# EasyEDA Pro project ProProject_训练营23_2023-12-06.epro, schematic 不带频谱时钟
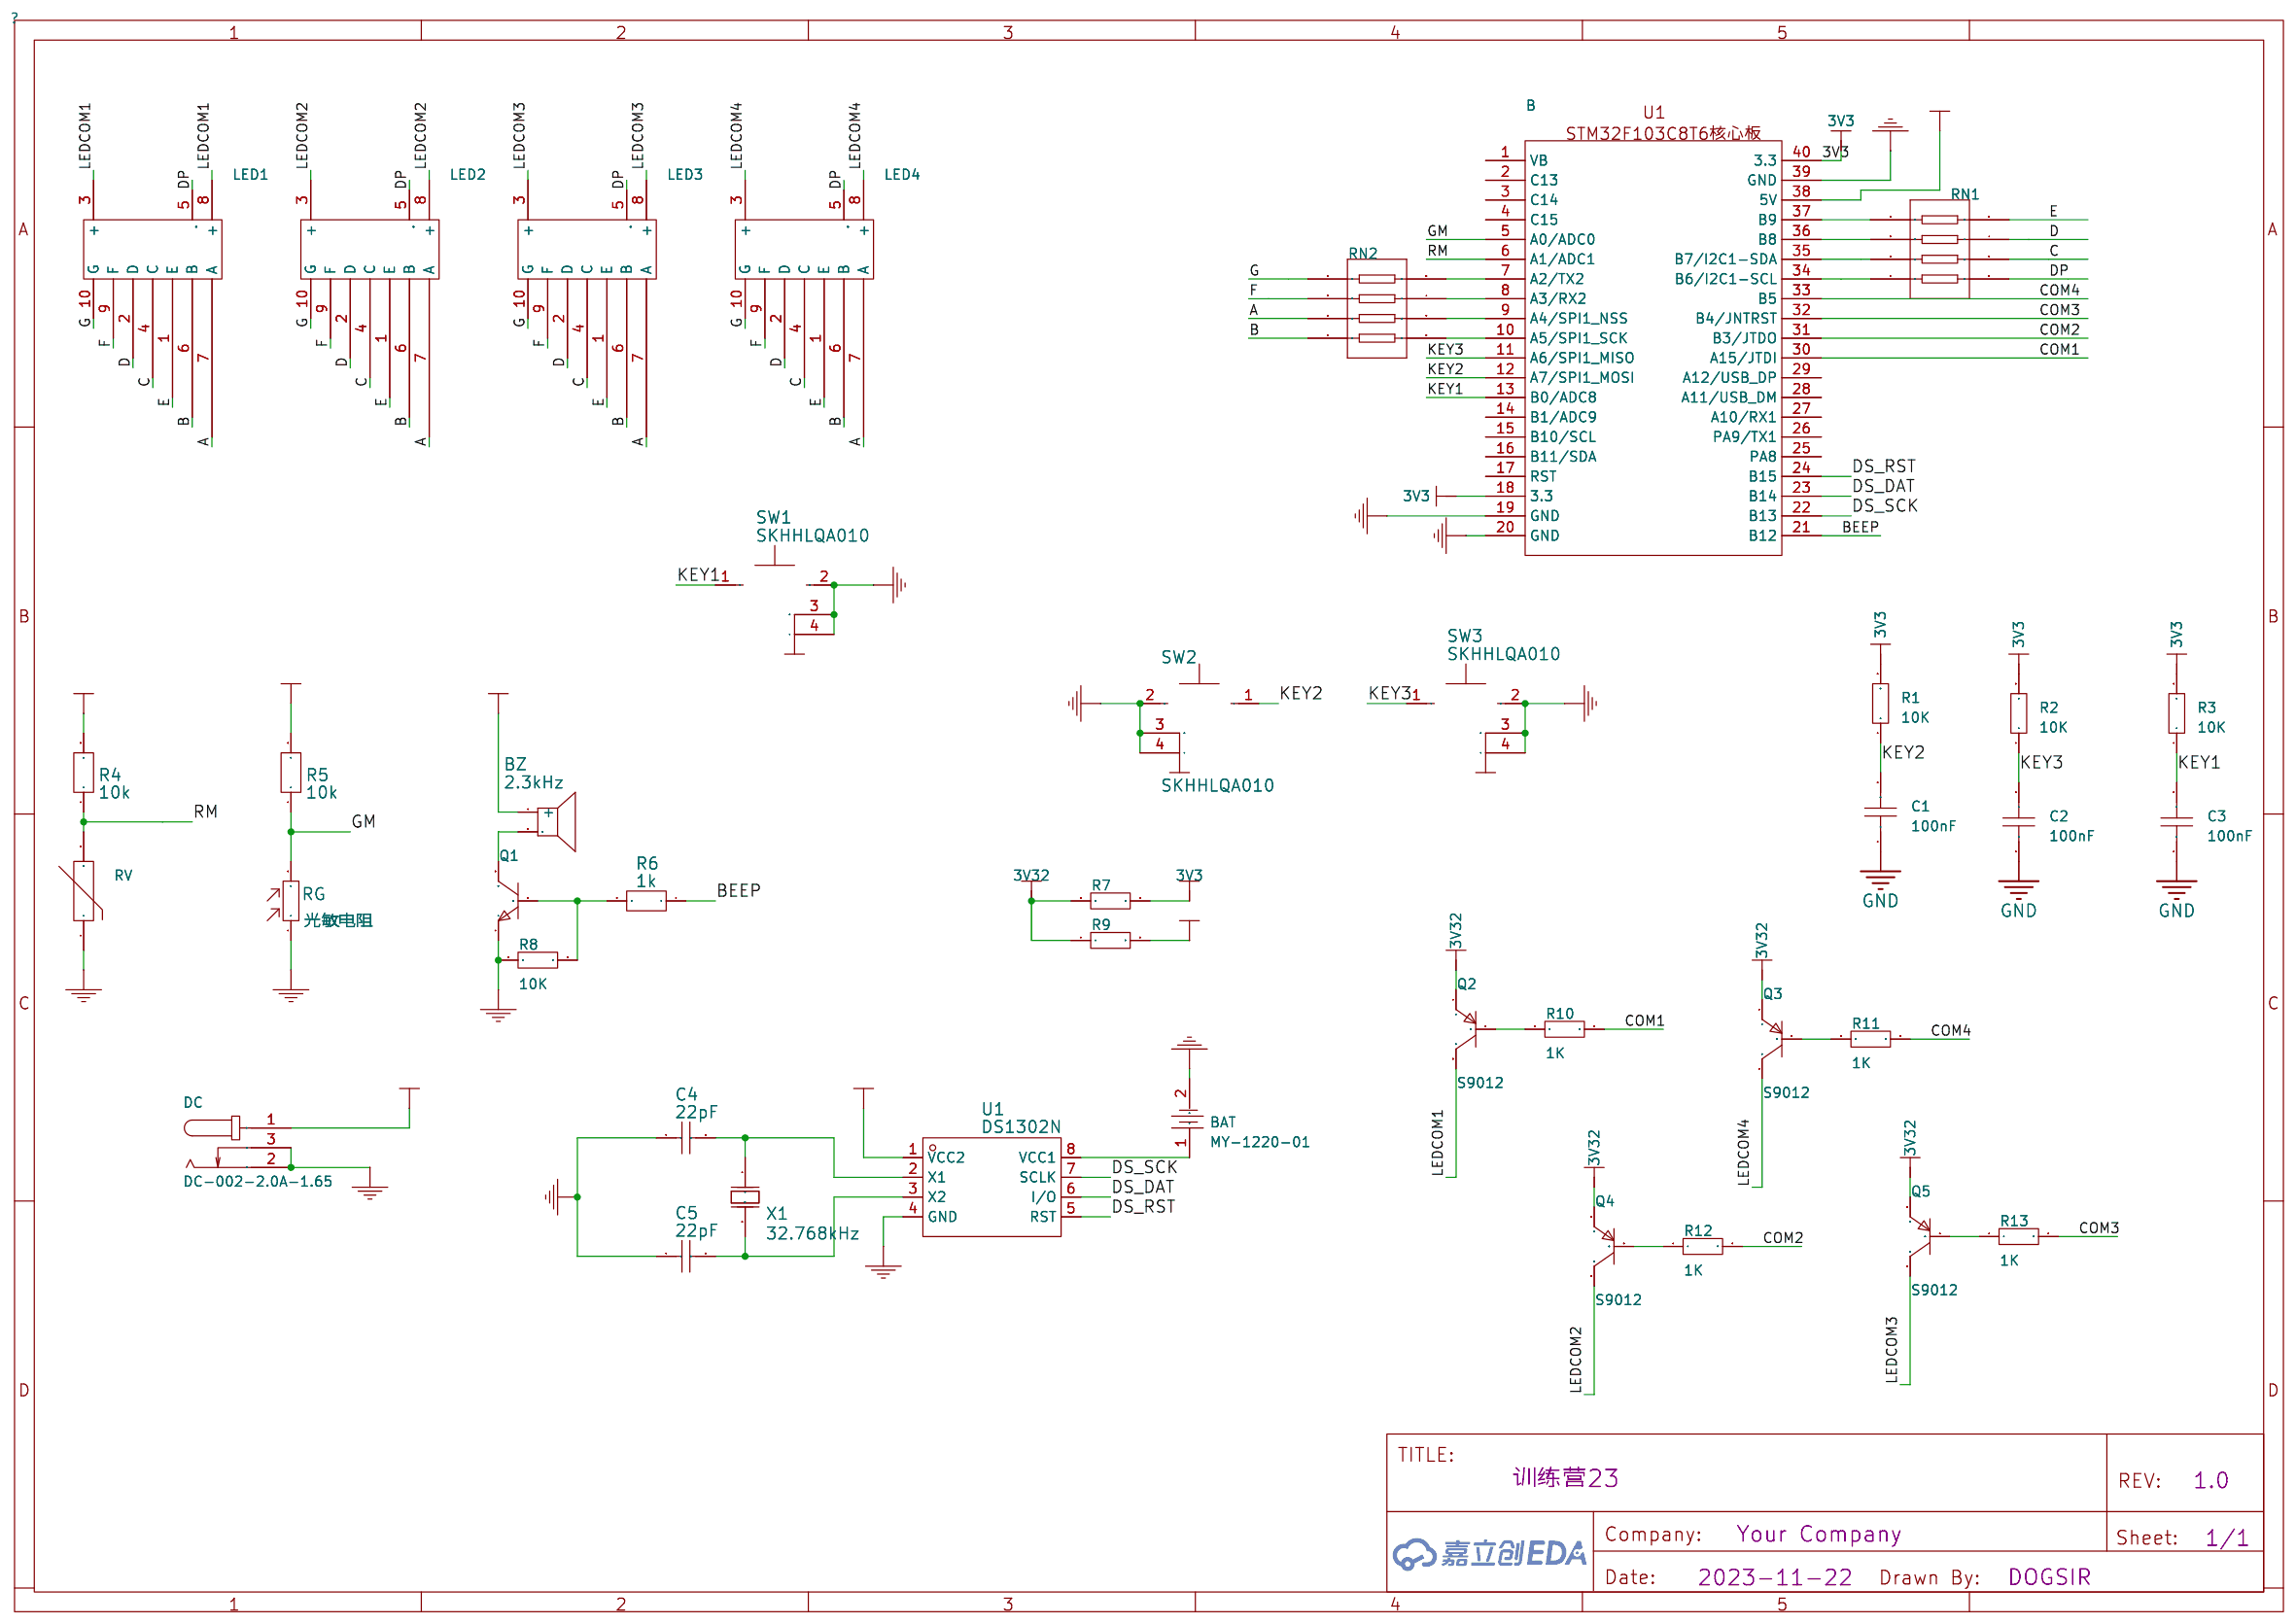
[diagram p0: schematic sheet]

## Parts
B  -  [STM32F103C8T6核心板]
BAT  MY-1220-01  [BAT-TH_MY-1220-01]
BZ  2.3kHz  [BUZ-TH_BD12.0-P7.60-D0.6-FD]
C1  100nF  [C0603]
C2  100nF  [C0603]
C3  100nF  [C0603]
C4  22pF  [C0603]
C5  22pF  [C0603]
DC  DC-002-2.0A-1.65  [DC-IN_DC-002-2.0A-1.65]
LED1  -  [1寸数码管]
LED2  -  [1寸数码管]
LED3  -  [1寸数码管]
LED4  -  [1寸数码管]
Q1  -  [S8050_TO_92]
Q2  S9012  [S8550P_TO-92]
Q3  S9012  [S8550P_TO-92]
Q4  S9012  [S8550P_TO-92]
Q5  S9012  [S8550P_TO-92]
R1  10K  [R0603]
R2  10K  [R0603]
R3  10K  [R0603]
R4  10k  [R0603]
R5  10k  [R0603]
R6  1k  [R0603]
R7  10K  [R0603]
R8  10K  [R0603]
R9  10K  [R0603]
R10  1K  [R0603]
R11  1K  [R0603]
R12  1K  [R0603]
R13  1K  [R0603]
RG  光敏电阻  [RES-TH_L5.1-W4.3-P3.40-D0.5]
RN1  470Ω  [RES-ARRAY-SMD_0603-8P-L3.2-W1.6-BL]
RN2  470Ω  [RES-ARRAY-SMD_0603-8P-L3.2-W1.6-BL]
RV  MF52A103F3950 (A1)  [RES-TH_L2.5-W2.5-P1.70-D0.3]
SW1  SKHHLQA010  [KEY-TH_4P-SKHHLQA010]
SW2  SKHHLQA010  [KEY-TH_4P-SKHHLQA010]
SW3  SKHHLQA010  [KEY-TH_4P-SKHHLQA010]
U1  DS1302N  [DIP-8_L9.7-W6.4-P2.54-LS7.6-BL]
X1  32.768kHz  [CRYSTAL-TH_BD2.1-P0.70-D0.3]

## Library data of the parts
B = STM32F103C8T6核心板
BAT = MY-1220-01: 连接器类型:电池扣;适用电池规格:CR1220;工作温度范围:-25℃~+85℃;; LCSC Part Name: 电池扣 适用电池:CR1220; Supplier Part: C964817; Manufacturer: MYOUNG(美阳); Supplier Footprint: 插件; JLCPCB Part Class: 扩展库; Datasheet: https://atta.szlcsc.com/upload/public/pdf/source/20201218/C964817_C6C7ADAA3E58F2D08F45EEE9D25BDAFE.pdf; Supplier: LCSC; Connector Type: 电池扣; Battery Type: CR1220; Operating Temperature Range: -25℃~+85℃
BZ = 2.3kHz: Supplier: LCSC; Manufacturer: 华能; Manufacturer Part: TMB12A05; Supplier Part: C96093; JLCPCB Part Class: Extended Part
C1-C3 = CAP_0603: Supplier Footprint: 0603
C4 C5 = 22pF: Supplier: LCSC; Supplier Part: C359297; Manufacturer: DARFON(达方); Manufacturer Part: C1608NP0122JGT; JLCPCB Part Class: Extended Part
DC = DC-002-2.0A-1.65: 连接器类型:DC电源插座;安装方式:弯插;触点内径:1.65mm;触点外径:4.2mm;额定电流:2A;额定电压:12V;触头材质:黄铜;工作温度范围:-20℃~+70℃;焊接温度(最大值):260℃;; LCSC Part Name: DC电源插座 内径:1.65mm 外径:4.2mm; Supplier Part: C692444; Manufacturer: XKB Connectivity(中国星坤); Supplier Footprint: 插件; JLCPCB Part Class: 扩展库; Datasheet: https://atta.szlcsc.com/upload/public/pdf/source/20211011/D8EEBFC3205CDB20BEF5BD9C2A833C06.pdf; Supplier: LCSC; Connector Type: DC电源插座; Mounting Style: 弯插; Inside Contact Diameter: 1.65mm; Outside Contact Diameter: 4.2mm; Current Rating (Max): 2A; Voltage Rating (Max): 12V; Contact Material: 黄铜; Operating Temperature Range: -20℃~+70℃; Welding Temperature (Max): 260℃
LED1-LED4 = 1寸数码管
Q1 = S8050_TO_NPN: Supplier Footprint: TO-92
Q2-Q5 = S8550_TO_PNP: Supplier Footprint: TO-92
R1-R3 R7-R13 = Res_0603: Supplier Footprint: 0603
R4-R6 = 10k: Supplier: LCSC; Supplier Part: C9900014833; Manufacturer: null; Manufacturer Part: 贴片电阻ChipResistors; JLCPCB Part Class: Extended Part
RG = GL5528(10-20): Supplier: LCSC; Manufacturer: ReliaPro; Supplier Part: C10081
RN1 RN2 = 4D03WGJ0471T5E: 阻值:470Ω;精度:±5%;单个元件功率:62.5mW;电阻器数:4;温度系数:±200ppm/℃;; LCSC Part Name: 470Ω ±5%; Supplier Part: C25510; Manufacturer: UNI-ROYAL(厚声); Supplier Footprint: 0603x4; Datasheet: https://atta.szlcsc.com/upload/public/pdf/source/20191224/C474318_2527498AE30E813171187CCD28401A71.pdf; Supplier: LCSC; Tolerance: ±5%; Power(Watts): 62.5mW; Number of Resistors: 4; Temperature Coefficient: ±200ppm/℃; Number of Pins: 8
RV = MF52A103F3950 (A1): 阻值(25℃):10kΩ;电阻精度:±1%;B值精度:±1%;B值(25℃/50℃):3950K;功率:50mW;最大稳态电流(25℃):-;B值(25℃/75℃):-;B值(25℃/85℃):-;B值(25℃/100℃):-;工作温度:-55℃~+125℃;; LCSC Part Name: 10kΩ 电阻精度:±1% 3950K; Supplier Part: C13879; Manufacturer: 时恒; Supplier Footprint: 直插,P=1.7mm; Datasheet: https://atta.szlcsc.com/upload/public/pdf/source/20181022/C13879_A3EC02A0ADE83AF2A724FC6C6FE0F41B.pdf; Supplier: LCSC; Resistance @ 25℃: 10kΩ; Resistance Tolerance: ±1%; B Constant Tolerance: ±1%; B Constant (25℃/50℃): 3950K; Power: 50mW; Operating Temperature: -55℃~+125℃
SW1-SW3 = SKHHLQA010: Supplier: LCSC; Manufacturer: ALPSALPINE(阿尔卑斯阿尔派); Supplier Part: C125034; JLCPCB Part Class: Extended Part
U1 = DS1302N: Supplier: LCSC; Supplier Part: C398065; Manufacturer: HGSEMI; JLCPCB Part Class: Extended Part
X1 = 32.768kHz: Supplier: LCSC; Supplier Part: C2934679; Manufacturer: KDS(大真空); Manufacturer Part: DT-26T 32.768K 20PPM 12.5PF; JLCPCB Part Class: Extended Part

## Nets
3V3: R1.2 R2.2 R3.2 R4.2 R5.2 R7.2
3V32: Q2.1(E) Q3.1(E) Q4.1(E) Q5.1(E) R7.1 R9.1
GND: BAT.2 C1.1 C2.1 C3.1 C4.1 C5.1 DC.2 DC.3 Q1.1(E) R8.1 RG.1 RV.1 SW1.2 SW1.3 SW1.4 SW2.2 SW2.3 SW2.4 SW3.2 SW3.3 SW3.4 U1.4(GND)
VCC: BZ.1(+) DC.1 R9.2 U1.1(VCC2)
A: LED1.7(A) LED2.7(A) LED3.7(A) LED4.7(A) RN2.3
B: LED1.6(B) LED2.6(B) LED3.6(B) LED4.6(B) RN2.4
BEEP: B.21(B12) R6.1
C: LED1.4(C) LED2.4(C) LED3.4(C) LED4.4(C) RN1.6
COM1: B.30(A15/JTDI) R10.2
COM2: B.31(B3/JTDO) R12.2
COM3: B.32(B4/JNTRST) R13.2
COM4: B.33(B5) R11.2
D: LED1.2(D) LED2.2(D) LED3.2(D) LED4.2(D) RN1.7
DP: LED1.5(.) LED2.5(.) LED3.5(.) LED4.5(.) RN1.5
DS_DAT: B.23(B14) U1.6(I/O)
DS_RST: B.24(B15) U1.5(RST)
DS_SCK: B.22(B13) U1.7(SCLK)
E: LED1.1(E) LED2.1(E) LED3.1(E) LED4.1(E) RN1.8
F: LED1.9(F) LED2.9(F) LED3.9(F) LED4.9(F) RN2.2
G: LED1.10(G) LED2.10(G) LED3.10(G) LED4.10(G) RN2.1
GM: B.5(A0/ADC0) R5.1 RG.2
KEY1: B.13(B0/ADC8) C3.2 R3.1 SW1.1
KEY2: B.12(A7/SPI1_MOSI) C1.2 R1.1 SW2.1
KEY3: B.11(A6/SPI1_MISO) C2.2 R2.1 SW3.1
LEDCOM1: LED1.3(+) LED1.8(+) Q2.3(C)
LEDCOM2: LED2.3(+) LED2.8(+) Q4.3(C)
LEDCOM3: LED3.3(+) LED3.8(+) Q5.3(C)
LEDCOM4: LED4.3(+) LED4.8(+) Q3.3(C)
RM: B.6(A1/ADC1) R4.1 RV.2
$1N45: BZ.2 Q1.3(C)
$1N120: BAT.1 U1.8(VCC1)
$1N175: C4.2 U1.2(X1) X1.1
$1N176: C5.2 U1.3(X2) X1.2
$1N3437: Q1.2(B) R6.2 R8.2
$1N3552: Q2.2(B) R10.1
$1N3648: Q3.2(B) R11.1
$1N3719: Q4.2(B) R12.1
$1N3790: Q5.2(B) R13.1
$1N4595: B.37(B9) RN1.1
$1N4627: B.36(B8) RN1.2
$1N4659: B.35(B7/I2C1-SDA) RN1.3
$1N4691: B.34(B6/I2C1-SCL) RN1.4
$1N4827: B.7(A2/TX2) RN2.8
$1N4832: B.8(A3/RX2) RN2.7
$1N4837: B.9(A4/SPI1_NSS) RN2.6
$1N4842: B.10(A5/SPI1_SCK) RN2.5

Not connected (* = marked no-connect by the designer): B 1(VB) 2(C13) 3(C14) 4(C15) 14(B1/ADC9) 15(B10/SCL) 16(B11/SDA) 17(RST) 18(3.3) 19(GND) 20(GND) 25(PA8) 26(PA9/TX1) 27(A10/RX1) 28(A11/USB_DM) 29(A12/USB_DP) 38(5V) 39(GND) 40(3.3)
